# EAGLE design TeensyBoy Rev1 (EAGLE 8.1.0)
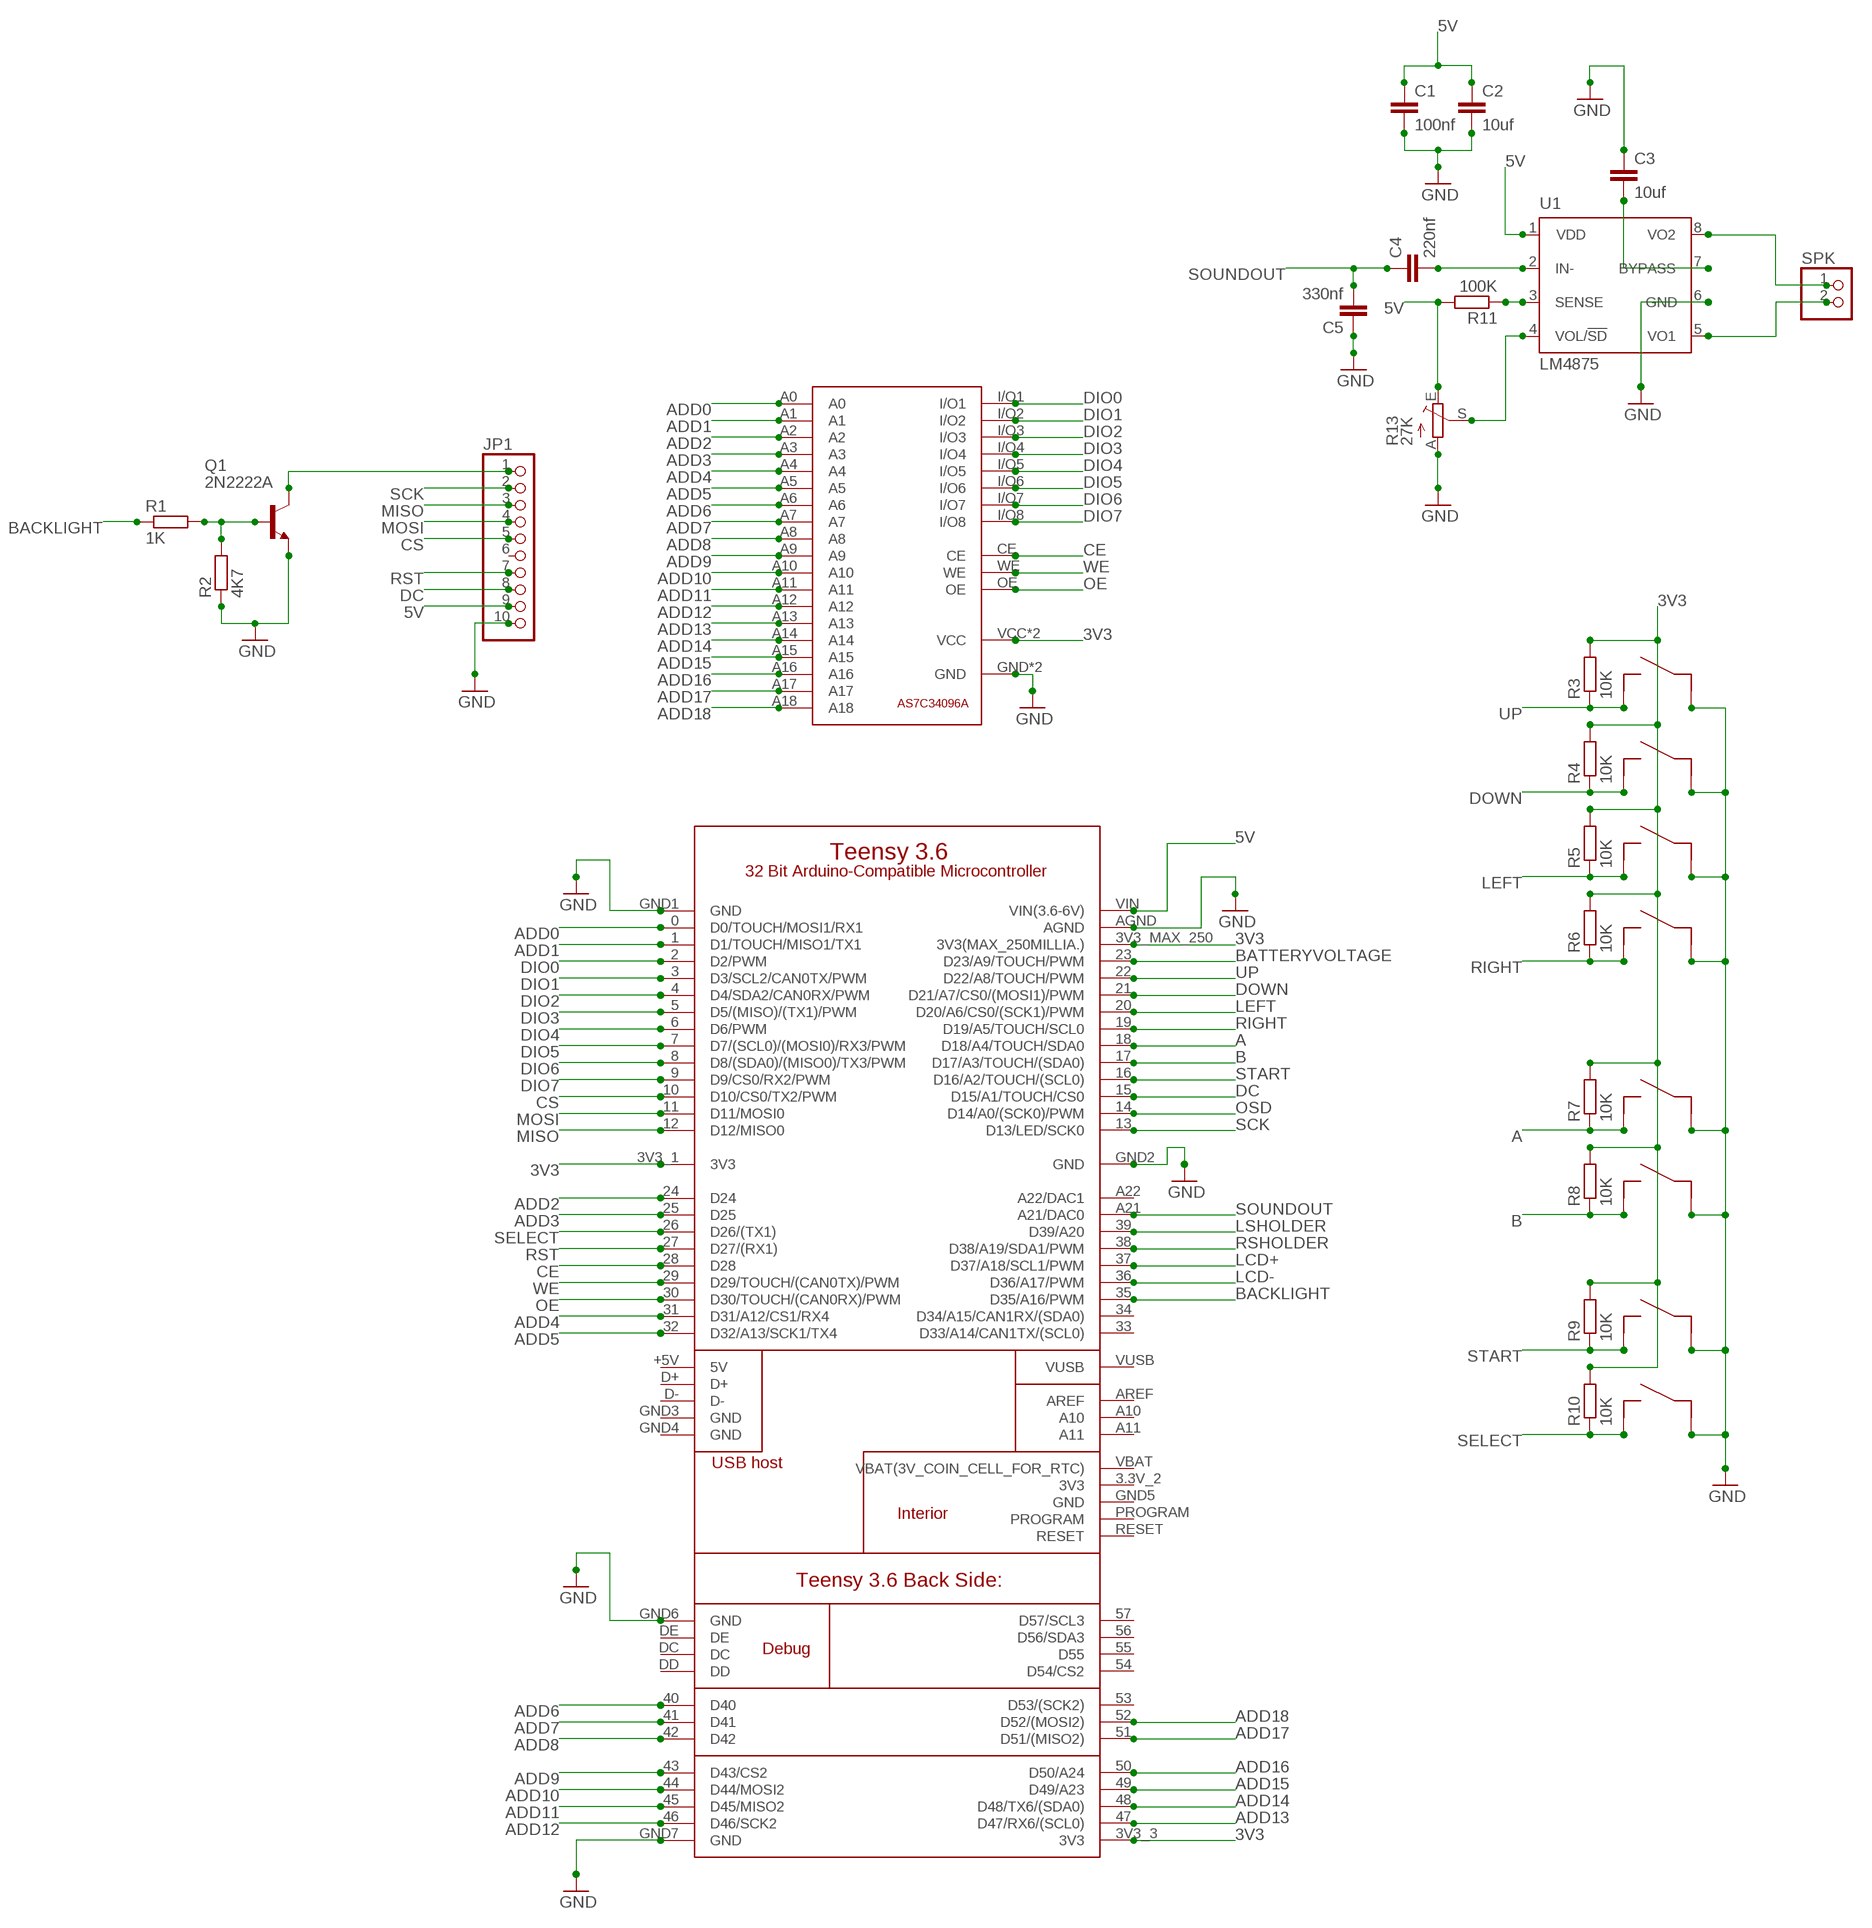
[diagram p0: schematic, sheet 1]

## Parts
A  DTS-3  [DTS-3]
B  DTS-3  [DTS-3]
C1  100nf  C-EUC0603K  [C0603K]
C2  10uf  C-EUC0603K  [C0603K]
C3  10uf  C-EUC0603K  [C0603K]
C4  220nf  C-EUC0603K  [C0603K]
C5  330nf  C-EUC0603K  [C0603K]
DOWN  DTS-3  [DTS-3]
JP1  PINHD-1X10  [1X10]
LEFT  DTS-3  [DTS-3]
Q1  2N2222A  [TO18]
R1  1K  R-EU_R0603  [R0603]
R2  4K7  R-EU_R0603  [R0603]
R3  10K  R-EU_R0603  [R0603]
R4  10K  R-EU_R0603  [R0603]
R5  10K  R-EU_R0603  [R0603]
R6  10K  R-EU_R0603  [R0603]
R7  10K  R-EU_R0603  [R0603]
R8  10K  R-EU_R0603  [R0603]
R9  10K  R-EU_R0603  [R0603]
R10  10K  R-EU_R0603  [R0603]
R11  100K  R-EU_R0603  [R0603]
R13  27K  TRIM_EU-CT6  [CT6]
RIGHT  DTS-3  [DTS-3]
SELECT  DTS-3  [DTS-3]
SPK  PINHD-1X2  [1X02]
START  DTS-3  [DTS-3]
U1  LM4875  [SO-8]
U$1  AS7C34096A  [AS7C34096A]
U$2  TEENSY-3.6_FULL  [TEENSY-3.6_FULL]
UP  DTS-3  [DTS-3]

## Nets
3V3: R3.2 R4.2 R5.2 R6.2 R7.2 R8.2 R9.2 R10.2 U$1.VCC U$1.VCC0(VCC) U$2.3V3_1(3V3) U$2.3V3_3(3V3) U$2.3V3_MAX_250(3V3(MAX_250MILLIA.))
5V: C1.1 C2.1 JP1.9 R11.2 R13.E U1.1(VDD) U$2.VIN(VIN(3.6-6V))
A: A.P$1 R7.1 U$2.18(D18/A4/TOUCH/SDA0)
ADD0: U$1.A0 U$2.0(D0/TOUCH/MOSI1/RX1)
ADD1: U$1.A1 U$2.1(D1/TOUCH/MISO1/TX1)
ADD2: U$1.A2 U$2.24(D24)
ADD3: U$1.A3 U$2.25(D25)
ADD4: U$1.A4 U$2.31(D31/A12/CS1/RX4)
ADD5: U$1.A5 U$2.32(D32/A13/SCK1/TX4)
ADD6: U$1.A6 U$2.40(D40)
ADD7: U$1.A7 U$2.41(D41)
ADD8: U$1.A8 U$2.42(D42)
ADD9: U$1.A9 U$2.43(D43/CS2)
ADD10: U$1.A10 U$2.44(D44/MOSI2)
ADD11: U$1.A11 U$2.45(D45/MISO2)
ADD12: U$1.A12 U$2.46(D46/SCK2)
ADD13: U$1.A13 U$2.47(D47/RX6/(SCL0))
ADD14: U$1.A14 U$2.48(D48/TX6/(SDA0))
ADD15: U$1.A15 U$2.49(D49/A23)
ADD16: U$1.A16 U$2.50(D50/A24)
ADD17: U$1.A17 U$2.51(D51/(MISO2))
ADD18: U$1.A18 U$2.52(D52/(MOSI2))
B: B.P$1 R8.1 U$2.17(D17/A3/TOUCH/(SDA0))
BACKLIGHT: R1.1 U$2.35(D35/A16/PWM)
BATTERYVOLTAGE: U$2.23(D23/A9/TOUCH/PWM)
CE: U$1.CE U$2.28(D28)
CS: JP1.5 U$2.10(D10/CS0/TX2/PWM)
DC: JP1.8 U$2.15(D15/A1/TOUCH/CS0)
DIO0: U$1.I/O1 U$2.2(D2/PWM)
DIO1: U$1.I/O2 U$2.3(D3/SCL2/CAN0TX/PWM)
DIO2: U$1.I/O3 U$2.4(D4/SDA2/CAN0RX/PWM)
DIO3: U$1.I/O4 U$2.5(D5/(MISO)/(TX1)/PWM)
DIO4: U$1.I/O5 U$2.6(D6/PWM)
DIO5: U$1.I/O6 U$2.7(D7/(SCL0)/(MOSI0)/RX3/PWM)
DIO6: U$1.I/O7 U$2.8(D8/(SDA0)/(MISO0)/TX3/PWM)
DIO7: U$1.I/O8 U$2.9(D9/CS0/RX2/PWM)
DOWN: DOWN.P$1 R4.1 U$2.21(D21/A7/CS0/(MOSI1)/PWM)
GND: A.P$2 B.P$2 C1.2 C2.2 C3.1 C5.1 DOWN.P$2 JP1.10 LEFT.P$2 Q1.1(E) R2.1 R13.A RIGHT.P$2 SELECT.P$2 START.P$2 U1.6(GND) U$1.GND U$1.GND0(GND) U$2.AGND U$2.GND1(GND) U$2.GND2(GND) U$2.GND6(GND) U$2.GND7(GND) UP.P$2
LCD+: U$2.37(D37/A18/SCL1/PWM)
LCD-: U$2.36(D36/A17/PWM)
LEFT: LEFT.P$1 R5.1 U$2.20(D20/A6/CS0/(SCK1)/PWM)
LSHOLDER: U$2.39(D39/A20)
MISO: JP1.3 U$2.12(D12/MISO0)
MOSI: JP1.4 U$2.11(D11/MOSI0)
N$1: JP1.1 Q1.3(C)
N$2: Q1.2(B) R1.2 R2.2
N$3: C3.2 U1.7(BYPASS)
N$4: C4.2 U1.2(IN-)
N$6: R11.1 U1.3(SENSE)
N$7: SPK.1 U1.8(VO2)
N$8: SPK.2 U1.5(VO1)
N$10: R13.S U1.4(VOL/!SD)
OE: U$1.OE U$2.30(D30/TOUCH/(CAN0RX)/PWM)
OSD: U$2.14(D14/A0/(SCK0)/PWM)
RIGHT: R6.1 RIGHT.P$1 U$2.19(D19/A5/TOUCH/SCL0)
RSHOLDER: U$2.38(D38/A19/SDA1/PWM)
RST: JP1.7 U$2.27(D27/(RX1))
SCK: JP1.2 U$2.13(D13/LED/SCK0)
SELECT: R10.1 SELECT.P$1 U$2.26(D26/(TX1))
SOUNDOUT: C4.1 C5.2 U$2.A21(A21/DAC0)
START: R9.1 START.P$1 U$2.16(D16/A2/TOUCH/(SCL0))
UP: R3.1 U$2.22(D22/A8/TOUCH/PWM) UP.P$1
WE: U$1.WE U$2.29(D29/TOUCH/(CAN0TX)/PWM)
Unconnected: JP1.6 U$2.3.3V_2(3V3) U$2.33(D33/A14/CAN1TX/(SCL0)) U$2.34(D34/A15/CAN1RX/(SDA0)) U$2.53(D53/(SCK2)) U$2.54(D54/CS2) U$2.55(D55) U$2.56(D56/SDA3) U$2.57(D57/SCL3) U$2.+5V(5V) U$2.A10 U$2.A11 U$2.A22(A22/DAC1) U$2.AREF U$2.D+ U$2.D- U$2.DC U$2.DD U$2.DE U$2.GND3(GND) U$2.GND4(GND) U$2.GND5(GND) U$2.PROGRAM U$2.RESET U$2.VBAT(VBAT(3V_COIN_CELL_FOR_RTC)) U$2.VUSB

## Library data of the parts
A B DOWN LEFT RIGHT SELECT START UP = DTS-3:DTS-3
C1-C5 = rcl:C-EU: CAPACITOR, European symbol
JP1 = pinhead:PINHD-1X10: PIN HEADER
Q1 = transistor-npn:2N2222*: NPN Transistor
R1-R11 = rcl:R-EU_: RESISTOR, European symbol
R13 = pot:TRIM_EU-: POTENTIOMETER
SPK = pinhead:PINHD-1X2: PIN HEADER
U1 = lm4875:LM4875: LM4875 Boomer Audio Power Amplifier 750mW - with DC Volume Control and Headphone Switch
U$1 = AS7C34096A:AS7C34096A
U$2 = Teensy-3.6:TEENSY-3.6_FULL

## Board
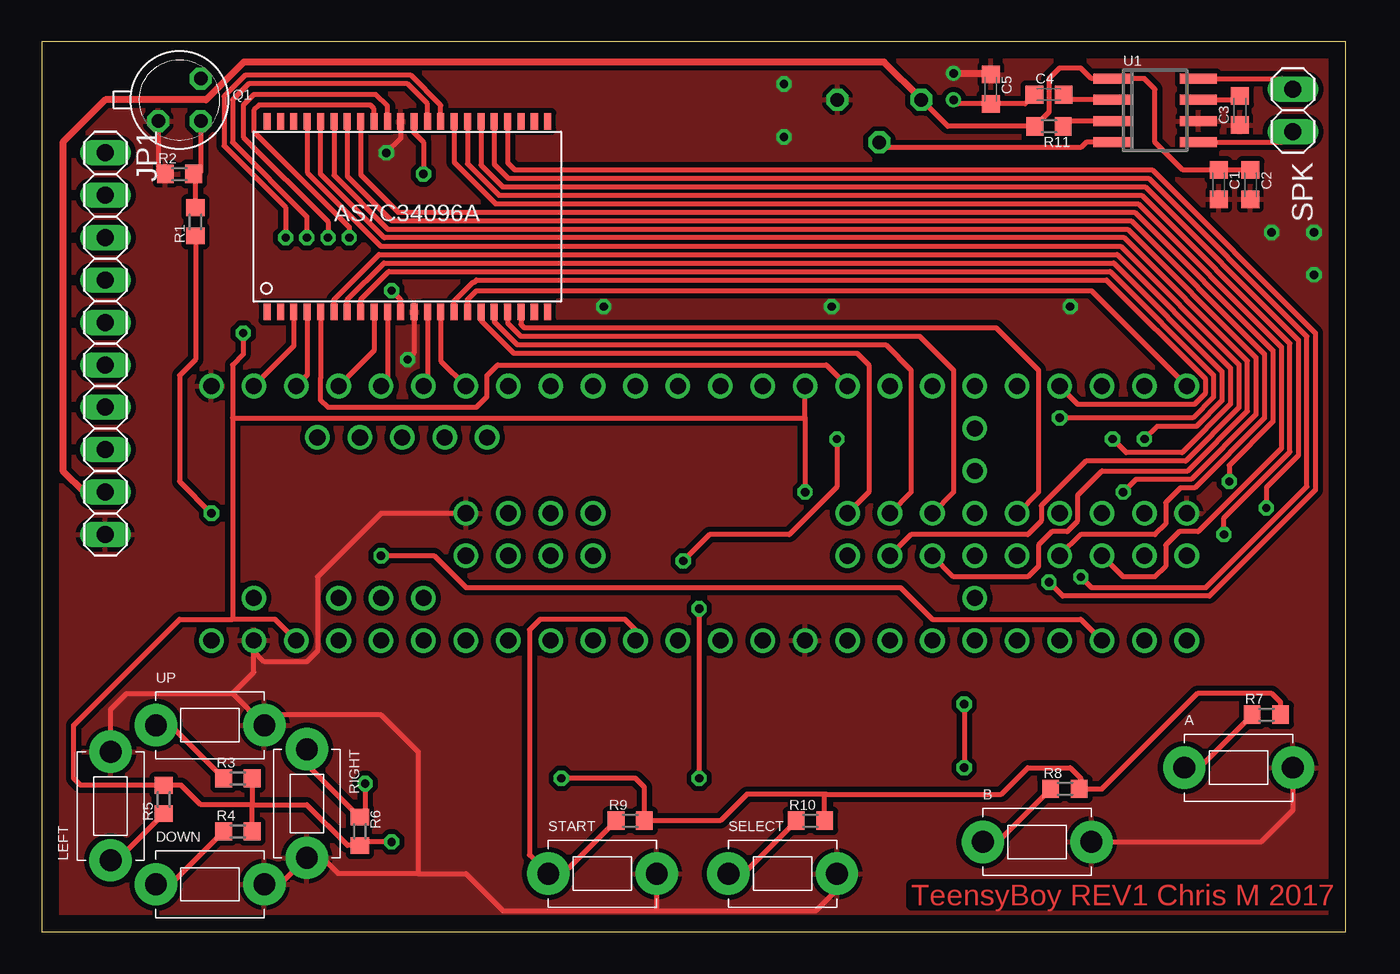
[diagram p1: board, top side]
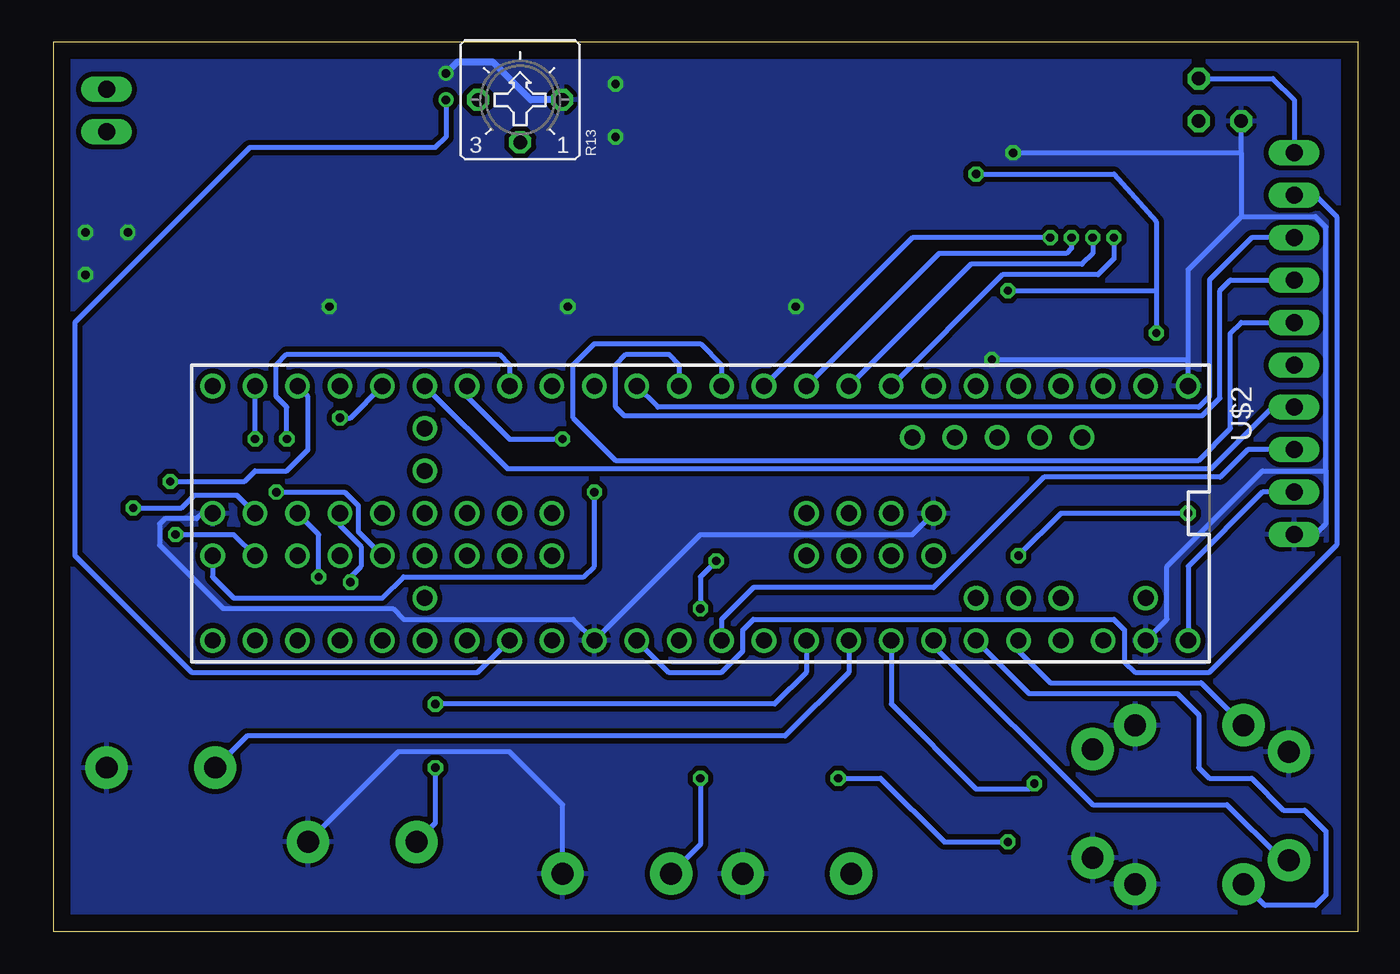
[diagram p2: board, bottom side, seen from below]

Size 78.08 x 53.33 mm. Coordinates in mm from the lower left corner, seen from the top.
Outline: 0,0 78.08,0 78.08,53.33 0,53.33 0,0
Copper layers (1*16): Top 0.035mm / dielectric 1.5mm / Bottom 0.035mm
Design rules "default": minimum track width 10mil, minimum drill 24mil, track to track 8mil, track to pad 8mil, pad to pad 8mil, via to via 8mil, smd to smd 8mil, copper to edge 40mil, drill to drill 8mil, minimum pad ring 10mil, minimum via ring 8mil, stop-mask expansion 4mil, vias tented up to drill 0mil, thermal gap 10mil

### Footprints (pad centres in the part's own frame; a part is rotated, then mirrored left to right if it is on the bottom)
DTS-3 = drill 1.3 pad 2.54: P$1 -3.175,0; P$2 3.325,0
C0603K = smd 1.05 x 1.08: 1 -0.875,0; 2 0.875,0
1X10 = drill 1.016 long: 1 -11.43,0; 2 -8.89,0; 3 -6.35,0; 4 -3.81,0; 5 -1.27,0; 6 1.27,0; 7 3.81,0; 8 6.35,0; 9 8.89,0; 10 11.43,0
TO18 = drill 0.813 octagon: 1 -1.27,-1.27; 2 1.27,-1.27; 3 1.27,1.27
R0603 = smd 1 x 1.1: 1 -0.85,0; 2 0.85,0
CT6 = drill 0.813 octagon: A 2.515,0; E -2.515,0; S 0,-2.54
1X02 = drill 1.016 long: 1 -1.27,0; 2 1.27,0
SO-8 = smd 2.2 x 0.6: 1 -2.6,1.905; 2 -2.6,0.635; 3 -2.6,-0.635; 4 -2.6,-1.905; 5 2.6,-1.905; 6 2.6,-0.635; 7 2.6,0.635; 8 2.6,1.905
AS7C34096A = smd 0.42 x 1: A0 2.4,0; A1 3.2,0; A2 4,0; A3 4.8,0; A4 5.6,0; A5 12.8,0; A6 13.6,0; A7 14.4,0; A8 15.2,0; A9 16,0; A10 15.2,11.4; A11 14.4,11.4; A12 13.6,11.4; A13 12.8,11.4; A14 12,11.4; A15 5.6,11.4; A16 4.8,11.4; A17 4,11.4; A18 3.2,11.4; CE 6.4,0; GND 9.6,0; GND0 8.8,11.4; I/O1 7.2,0; I/O2 8,0; I/O3 10.4,0; I/O4 11.2,0; I/O5 11.2,11.4; I/O6 10.4,11.4; I/O7 8,11.4; I/O8 7.2,11.4; NC 0.8,0; NC0 1.6,0; NC1 16.8,0; NC2 17.6,0; NC3 0.8,11.4; NC4 1.6,11.4; NC5 2.4,11.4; NC6 16,11.4; NC7 16.8,11.4; NC8 17.6,11.4; OE 6.4,11.4; VCC 8.8,0; VCC0 9.6,11.4; WE 12,0
TEENSY-3.6_FULL = drill 0.965: 0 -7.62,5.08; 1 -7.62,2.54; 2 -7.62,0; 3 -7.62,-2.54; 3.3V_2 -2.54,-38.1; 3V3_1 -7.62,-27.94; 3V3_3 2.54,-50.8; 3V3_MAX_250 7.62,2.54; 4 -7.62,-5.08; 5 -7.62,-7.62; 6 -7.62,-10.16; 7 -7.62,-12.7; 8 -7.62,-15.24; 9 -7.62,-17.78; 10 -7.62,-20.32; 11 -7.62,-22.86; 12 -7.62,-25.4; 13 7.62,-25.4; 14 7.62,-22.86; 15 7.62,-20.32; 16 7.62,-17.78; 17 7.62,-15.24; 18 7.62,-12.7; 19 7.62,-10.16; 20 7.62,-7.62; 21 7.62,-5.08; 22 7.62,-2.54; 23 7.62,0; 24 -7.62,-30.48; 25 -7.62,-33.02; 26 -7.62,-35.56; 27 -7.62,-38.1; 28 -7.62,-40.64; 29 -7.62,-43.18; 30 -7.62,-45.72; 31 -7.62,-48.26; 32 -7.62,-50.8; 33 7.62,-50.8; 34 7.62,-48.26; 35 7.62,-45.72; 36 7.62,-43.18; 37 7.62,-40.64; 38 7.62,-38.1; 39 7.62,-35.56; 40 0,-30.48; 41 0,-33.02; 42 0,-35.56; 43 0,-40.64; 44 0,-43.18; 45 0,-45.72; 46 0,-48.26; 47 2.54,-48.26; 48 2.54,-45.72; 49 2.54,-43.18; 50 2.54,-40.64; 51 2.54,-35.56; 52 2.54,-33.02; 53 2.54,-30.48; 54 2.54,-15.24; 55 2.54,-12.7; 56 2.54,-10.16; 57 2.54,-7.62; +5V -4.547,1.27; A10 5.08,-2.54; A11 5.08,-5.08; A21 7.62,-33.02; A22 7.62,-30.48; AGND 7.62,5.08; AREF 5.08,0; D+ -4.547,-3.81; D- -4.547,-1.27; DC 0,-12.7; DD 0,-15.24; DE 0,-10.16; GND1 -7.62,7.62; GND2 7.62,-27.94; GND3 -4.547,-6.35; GND4 -4.547,-8.89; GND5 0,-38.1; GND6 0,-7.62; GND7 0,-50.8; PROGRAM 2.54,-38.1; RESET 5.08,-38.1; VBAT -5.08,-38.1; VIN 7.62,7.62; VUSB 5.08,5.08

### Placement (x,y rotation side)
A  71.61,9.84 0 top
B  59.54,5.4 0 top
C1  70.48,44.77 270 top
C2  72.39,44.77 270 top
C3  71.75,49.21 90 top
C4  60.33,50.16 0 top
C5  56.83,50.48 270 top
DOWN  10.01,2.86 0 top
JP1  3.81,35.24 270 top
LEFT  4.13,7.47 90 top
Q1  8.26,49.85 0 top
R1  9.21,42.55 90 top
R2  8.26,45.4 0 top
R3  11.75,9.21 0 top
R4  11.75,6.03 0 top
R5  7.3,7.94 90 top
R6  19.05,6.03 270 top
R7  73.34,13.02 0 top
R8  61.28,8.57 0 top
R9  35.24,6.67 0 top
R10  46.04,6.67 0 top
R11  60.33,48.26 180 top
R13  50.16,49.85 0 bottom
RIGHT  15.88,7.77 270 top
SELECT  44.3,3.49 0 top
SPK  74.93,49.21 270 top
START  33.51,3.49 0 top
U1  66.67,49.21 0 top
U$1  12.7,37.15 0 top
U$2  17.78,25.08 270 bottom
UP  10.01,12.38 0 top

### Tracks (layer width: path | path; a pad name or v marks a point on that pad's centre or on a via)
3V3  (via drill 0.5)
  Top 0.305: U$1.VCC 21.5,37.87 v20.95,38.42 | v12.06,35.88 12.06,34.61 11.43,33.97 11.43,30.8 | 11.43,30.8 11.43,18.73 | 11.43,18.73 13.97,18.73 U$2.3V3_MAX_250 | U$1.VCC0 22.3,47.87 22.86,47.31 v22.86,45.4 | 45.72,30.8 v45.72,26.35 | 45.72,30.8 U$2.3V3_1 | 11.43,30.8 45.72,30.8 | 12.7,7.62 15.88,7.62 18.31,5.18 R6.2 19.27,5.4 v20.95,5.4 | 12.7,7.62 9.53,7.62 8.36,8.79 R5.2 2.33,8.79 1.91,9.21 1.91,12.38 8.26,18.73 11.43,18.73 | R4.2 12.6,7.52 12.7,7.62 | R3.2 12.6,7.72 12.7,7.62 | R7.2 74.19,13.76 73.66,14.29 69.22,14.29 63.5,8.57 R8.2 62.23,8.67 62.23,9.21 61.59,9.84 59.05,9.84 57.47,8.26 46.99,8.26 | 46.99,8.26 42.23,8.26 40.64,6.67 R9.2 36.09,8.67 35.56,9.21 v31.11,9.21 | 46.99,8.26 46.89,8.15 R10.2
  Bottom 0.305: v20.95,38.42 12.06,38.42 | 12.06,38.42 v12.06,35.88 | v22.86,45.4 14.61,45.4 12.06,42.54 12.06,38.42 | U$2.3V3_3 68.58,21.27 67.31,20 58.42,20 57.15,21.27 46.35,21.27 45.72,21.91 v45.72,26.35 | v31.11,9.21 28.57,9.21 24.77,5.4 v20.95,5.4
5V
  Top 0.305: C2.1 C1.1 68.34,45.64 66.67,47.31 66.67,50.48 66.04,51.12 U1.1 62.87,51.12 62.23,51.75 60.96,51.75 60.33,51.12 60.33,49.11 R11.2 54.27,48.26 R13.E
  Top 0.406: R13.E 52.68,49.87 50.44,52.11 12.1,52.11 9.84,49.85 3.81,49.85 1.27,47.31 1.27,27.62 2.54,26.35 JP1.9
  Bottom 0.305: JP1.9 5.71,26.35 10.16,21.91 U$2.VIN
A
  Top 0.305: A.P$1 69.32,9.84 R7.1
  Bottom 0.305: U$2.18 30.48,15.56 34.29,11.75 66.53,11.75 A.P$1
ADD0
  Top 0.305: U$1.A0 15.1,35.1 U$2.0
ADD1
  Top 0.305: U$1.A1 15.9,33.36 U$2.1
ADD2
  Top 0.305: U$1.A2 16.7,33.17 16.69,33.15 16.69,31.89 17.14,31.43 26.04,31.43 26.67,32.07 26.67,33.34 27.3,33.97 46.99,33.97 U$2.24
ADD3  (via drill 0.5)
  Top 0.305: v64.14,29.53 64.94,28.72 68.3,28.72 71.2,31.62 71.2,33.79 64.41,40.58 20.2,40.58 17.5,37.88 U$1.A3
  Bottom 0.305: v64.14,29.53 64.14,31.43 64.77,32.07 64.77,33.97 64.14,34.61 51.44,34.61 50.8,33.97 U$2.25
ADD4  (via drill 0.5)
  Top 0.305: v66.04,29.53 66.8,30.29 69.15,30.29 70.69,31.83 70.69,33.58 64.19,40.07 20.49,40.07 18.3,37.88 U$1.A4
  Bottom 0.305: v66.04,29.53 U$2.31
ADD5
  Top 0.305: U$1.A5 25.5,37.88 26.04,38.42 62.87,38.42 U$2.32
ADD6
  Top 0.305: U$1.A6 26.3,36.63 28.26,34.67 48.83,34.67 49.53,33.97 49.53,26.35 U$2.40
ADD7
  Top 0.305: U$1.A7 27.1,36.55 28.47,35.18 50.55,35.18 52.07,33.65 52.07,26.35 U$2.41
ADD8
  Top 0.305: U$1.A8 27.9,36.47 28.68,35.69 52.58,35.69 54.61,33.65 54.61,26.35 U$2.42
ADD9
  Top 0.305: U$1.A9 28.7,36.39 28.89,36.19 57.15,36.19 59.69,33.65 59.69,26.35 U$2.43
ADD10  (via drill 0.5)
  Top 0.305: U$1.A10 27.9,46.08 28.32,45.66 66.51,45.66 76.28,35.89 76.28,26.47 69.93,20.13 61.15,20.13 v60.33,20.95
  Bottom 0.305: v60.33,20.95 60.33,21.27 59.69,21.91 59.69,23.09 60.96,24.36 U$2.44
ADD11  (via drill 0.5)
  Top 0.305: U$1.A11 27.1,45.99 27.94,45.15 66.3,45.15 75.77,35.68 75.77,26.68 69.72,20.64 62.87,20.64 v62.23,21.27
  Bottom 0.305: v62.23,21.27 62.23,23.81 U$2.45
ADD12  (via drill 0.5)
  Top 0.305: U$1.A12 26.3,45.94 27.6,44.64 66.09,44.64 75.26,35.47 75.26,28.55 73.34,26.63 v73.34,25.4
  Bottom 0.305: v73.34,25.4 70.44,25.4 69.67,26.17 67.13,26.17 U$2.46
ADD13  (via drill 0.5)
  Top 0.305: U$1.A13 25.5,46.02 27.39,44.13 65.88,44.13 74.75,35.26 74.75,28.76 70.8,24.81 v70.8,23.81
  Bottom 0.305: v70.8,23.81 67.31,23.81 U$2.47
ADD14
  Top 0.305: U$1.A14 24.7,46.1 27.18,43.62 65.67,43.62 74.24,35.05 74.24,28.97 69.27,23.99 68.12,23.99 67.31,23.18 67.31,21.91 66.67,21.27 64.77,21.27 U$2.48
ADD15
  Top 0.305: U$1.A15 18.3,45.26 20.95,42.61 65.25,42.61 73.23,34.63 73.23,30.78 69.06,26.61 68.2,26.61 67.31,25.72 67.31,24.45 66.67,23.81 62.23,23.81 U$2.49
ADD16  (via drill 0.5)
  Top 0.305: U$1.A16 17.5,45.33 20.73,42.1 65.04,42.1 72.72,34.42 72.72,30.99 68.85,27.11 65.53,27.11 v64.77,26.35
  Bottom 0.305: U$2.50 59.87,23.99 59.87,25.53 60.69,26.35 v64.77,26.35
ADD17
  Top 0.305: U$1.A17 16.7,45.41 20.52,41.59 64.83,41.59 72.21,34.21 72.21,31.2 68.64,27.62 63.5,27.62 62.05,26.17 62.05,24.63 61.41,23.99 60.51,23.99 59.7,23.18 59.69,23.18 59.69,21.91 59.05,21.27 54.61,21.27 U$2.51
ADD18
  Top 0.305: U$2.52 52.07,23.81 59.05,23.81 59.87,24.63 59.87,25.53 62.54,28.21 68.51,28.21 71.7,31.41 71.7,34 64.62,41.08 20.31,41.08 15.9,45.49 U$1.A18
B  (via drill 0.5)
  Top 0.305: B.P$1 57.25,5.4 R8.1 | v55.24,13.65 v55.24,9.84
  Bottom 0.305: U$2.17 33.02,15.56 34.92,13.65 v55.24,13.65 | v55.24,9.84 55.24,6.52 B.P$1
BACKLIGHT  (via drill 0.5)
  Top 0.305: R1.1 9.21,34.29 8.26,33.34 8.26,26.99 v10.16,25.08 | v20.32,22.54 23.5,22.54 25.4,20.64 51.44,20.64 53.34,18.73 62.23,18.73 U$2.35
  Bottom 0.305: v10.16,25.08 17.78,25.08 v20.32,22.54
CE  (via drill 0.5)
  Top 0.305: v60.96,30.8 68.94,30.8 70.18,32.04 70.18,33.37 63.98,39.56 20.78,39.56 19.1,37.88 U$1.CE
  Bottom 0.305: v60.96,30.8 60.33,30.8 U$2.28
CS
  Bottom 0.305: U$2.10 38.1,33.97 39.37,35.24 45.72,35.24 46.99,33.97 46.99,30.8 44.45,28.26 9.53,28.26 7.62,30.16 7.62,35.88 6.99,36.51 JP1.5
DC
  Bottom 0.305: U$2.15 38.1,18.73 36.2,20.64 25.4,20.64 18.8,27.24 8.23,27.24 6.58,28.89 JP1.8
DIO0
  Top 0.305: U$1.I/O1 19.9,34.82 U$2.2
DIO1
  Top 0.305: U$1.I/O2 20.7,33.08 U$2.3
DIO2
  Top 0.305: U$1.I/O3 23.1,32.94 U$2.4
DIO3
  Top 0.305: U$1.I/O4 23.9,34.2 U$2.5
DIO4  (via drill 0.5)
  Top 0.305: U$1.I/O5 23.9,49.53 22.12,51.31 12.17,51.31 10.92,50.06 10.92,47.1 14.61,43.41 v14.61,41.59
  Bottom 0.305: v14.61,41.59 14.61,40.32 15.56,39.37 21.27,39.37 U$2.6
DIO5  (via drill 0.5)
  Top 0.305: U$1.I/O6 23.1,49.61 21.91,50.8 12.38,50.8 11.43,49.85 11.43,47.31 15.88,42.86 v15.88,41.59
  Bottom 0.305: v15.88,41.59 15.88,40.64 16.51,40.01 23.18,40.01 U$2.7
DIO6  (via drill 0.5)
  Top 0.305: U$1.I/O7 20.7,49.47 20,50.16 12.7,50.16 12.06,49.53 12.06,47.62 17.14,42.54 v17.14,41.59
  Bottom 0.305: v17.14,41.59 17.14,40.96 17.46,40.64 25.08,40.64 U$2.8
DIO7  (via drill 0.5)
  Top 0.305: U$1.I/O8 19.9,49.32 19.68,49.53 13.02,49.53 12.7,49.21 12.7,47.94 18.41,42.23 v18.41,41.59
  Bottom 0.305: v18.41,41.59 26.67,41.59 U$2.9
DOWN
  Top 0.305: DOWN.P$1 7.72,2.86 R4.1
  Bottom 0.305: U$2.21 19.68,14.29 10.79,14.29 9.53,13.02 9.53,9.84 8.89,9.21 6.35,9.21 4.45,7.3 3.17,7.3 1.91,6.03 1.91,2.22 2.54,1.59 5.57,1.59 DOWN.P$1
GND  (via drill 0.5)
  Top 0.305: Q1.1 6.99,45.53 R2.1 | U$1.GND 22.3,34.68 v21.91,34.29 | U$1.GND0 21.5,47.54 v20.64,46.67 | U$2.GND6 20.32,25.08 16.51,21.27 16.51,16.83 15.88,16.19 13.34,16.19 12.7,16.83 U$2.AGND 12.7,15.56 11.43,14.29 | LEFT.P$2 4.13,13.34 5.08,14.29 11.43,14.29 | 11.43,14.29 UP.P$2 13.97,13.02 20.32,13.02 22.54,10.79 22.54,3.49 | DOWN.P$2 14.29,2.86 RIGHT.P$2 16.83,4.45 17.78,3.49 22.54,3.49 | START.P$2 36.83,1.27 | 36.83,1.27 46.35,1.27 47.62,2.54 SELECT.P$2 47.62,3.17 | A.P$2 74.93,7.3 73.03,5.4 B.P$2 | 36.83,1.27 27.62,1.27 25.4,3.49 22.54,3.49
  Top 0.406: v54.61,51.43 56.76,51.43 C5.1
  Bottom 0.305: JP1.10 2.54,23.81 1.91,24.45 1.91,27.62 | 1.91,27.62 1.91,42.23 2.54,42.86 6.99,42.86 | U$2.GND1 10.16,34.29 | 6.99,46.67 Q1.1 | 6.99,46.67 6.99,42.86 | v21.91,34.29 10.16,34.29 | 10.16,34.29 10.16,39.69 6.99,42.86 | U$2.AGND 11.43,18.73 11.43,21.91 5.71,27.62 1.91,27.62 | v20.64,46.67 6.99,46.67 | U$2.GND6 26.67,23.81 39.37,23.81 U$2.GND2 46.99,18.73 57.15,18.73 57.78,19.37 67.94,19.37 71.75,23.18 71.75,24.45 71.44,24.77 69.53,24.77 69.22,25.08 U$2.GND7 | SELECT.P$2 47.62,7.62 50.8,10.79 57.47,10.79 B.P$2
  Bottom 0.406: R13.A 49.53,49.85 51.79,52.11 53.94,52.11 v54.61,51.43
  other vias: 33.66,37.47 47.31,37.47 61.59,37.47 44.45,50.8 44.45,47.62 76.2,39.37 76.2,41.91 73.66,41.91
  pour Bottom (isolate 0.305): 0,53.34 78.11,53.34 78.11,0 0,0
  pour Top (isolate 0.305): 0,53.34 78.11,53.34 78.11,0 0,0
LEFT
  Top 0.305: LEFT.P$1 4.51,4.3 R5.1
  Bottom 0.305: U$2.20 25.4,17.15 15.88,7.62 7.83,7.62 4.71,4.5 4.33,4.5 LEFT.P$1
MISO
  Bottom 0.305: U$2.12 41.91,31.43 9.53,31.43 8.89,32.07 8.89,39.05 6.35,41.59 JP1.3
MOSI
  Bottom 0.305: U$2.11 40.64,33.97 41.27,34.61 43.81,34.61 44.45,33.97 44.45,31.43 43.94,30.92 9.31,30.92 8.26,31.98 8.26,38.42 7.62,39.05 JP1.4
N$1
  Bottom 0.305: Q1.3 5.08,51.12 3.81,49.85 JP1.1
N$2
  Top 0.305: Q1.2 9.53,45.53 R2.2 9.21,45.3 R1.2
N$3
  Top 0.305: U1.7 71.52,49.85 C3.2
N$4
  Top 0.305: U1.2 61.52,49.85 C4.2
N$6
  Top 0.305: U1.3 61.49,48.58 R11.1
N$7
  Top 0.305: U1.8 74.3,51.12 SPK.1
N$8
  Top 0.305: U1.5 74.3,47.31 SPK.2
N$10
  Top 0.305: U1.4 62.55,47.31 62.23,46.99 50.48,46.99 R13.S
OE  (via drill 0.5)
  Top 0.305: U$1.OE 19.1,45.35 21.34,43.12 65.46,43.12 73.74,34.84 73.74,30.57 71.12,27.95 v71.12,26.99
  Bottom 0.305: v71.12,26.99 66.67,26.99 66.04,27.62 64.14,27.62 62.87,28.89 62.87,32.07 U$2.30
RIGHT  (via drill 0.5)
  Top 0.305: RIGHT.P$1 15.88,10.06 R6.1 19.37,7.2 v19.37,8.89
  Bottom 0.305: U$2.19 27.94,13.65 22.86,8.57 19.68,8.57 v19.37,8.89
RST
  Bottom 0.305: U$2.27 50.93,27.75 8.76,27.75 5.08,31.43 JP1.7
SCK
  Bottom 0.305: U$2.13 41.27,15.56 38.1,15.56 36.83,16.83 36.83,18.1 36.2,18.73 14.61,18.73 13.97,18.1 13.97,16.19 13.34,15.56 8.89,15.56 1.27,23.18 1.27,42.86 2.54,44.13 JP1.2
SELECT  (via drill 0.5)
  Top 0.305: SELECT.P$1 42.01,3.49 R10.1 | v47.62,29.53 47.62,26.67 44.77,23.81 40.01,23.81 v38.42,22.22 | v39.37,19.37 v39.37,9.21
  Bottom 0.305: U$2.26 53.34,32.07 50.8,29.53 v47.62,29.53 | v38.42,22.22 39.37,21.27 v39.37,19.37 | v39.37,9.21 39.37,5.25 SELECT.P$1
SOUNDOUT  (via drill 0.5)
  Top 0.305: C4.1 58.89,49.61 C5.2 54.85,49.61 v54.61,49.85
  Bottom 0.305: v54.61,49.85 54.61,47.62 55.24,46.99 66.36,46.99 76.83,36.51 76.83,22.54 69.85,15.56 52.7,15.56 U$2.A21
START
  Top 0.305: R9.1 31.22,3.49 START.P$1 29.21,4.61 29.21,18.1 29.84,18.73 34.92,18.73 35.56,18.1 U$2.16
UP
  Top 0.305: UP.P$1 7.72,12.38 R3.1
  Bottom 0.305: U$2.22 20.32,16.83 18.41,14.92 9.38,14.92 UP.P$1
WE
  Top 0.305: U$1.WE 24.7,37.8 25.82,38.93 25.91,38.93 26.04,39.05 63.77,39.05 69.67,33.15 69.67,32.25 69.03,31.61 62.05,31.61 U$2.29

### Text on the board
Top: TeensyBoy REV1 Chris M 2017